# Altium schematic sheet Bluetooth.SchDoc: Bluetooth Module
size OrCAD A; DocumentNumber: LM_011; Revision: -; SheetNumber: 1; SheetTotal: 1
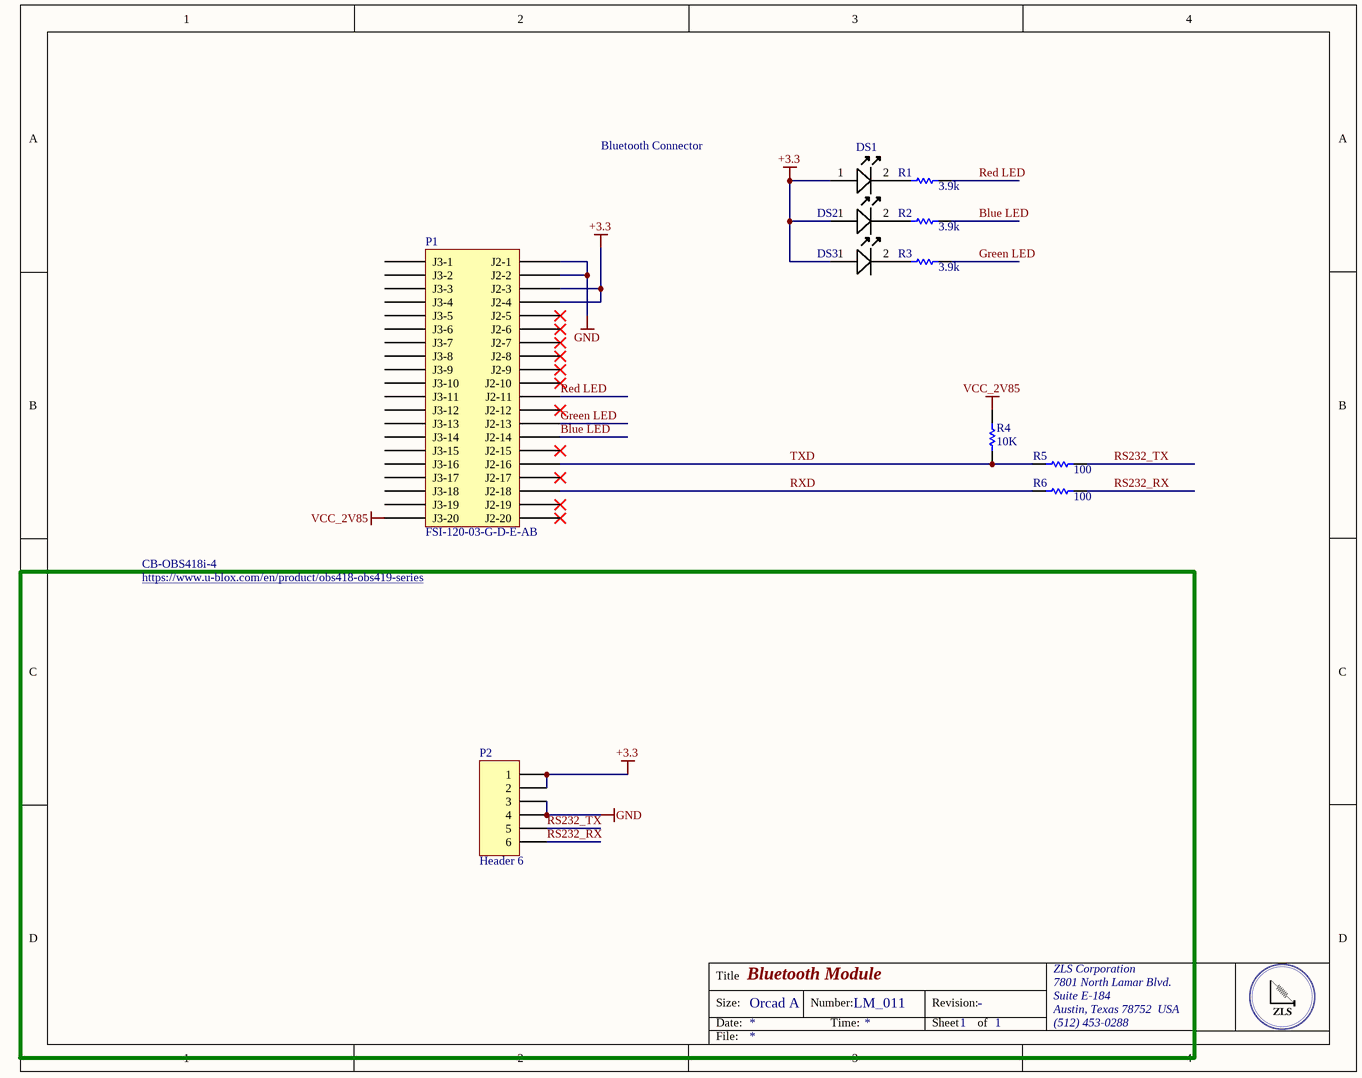
[diagram p0: Bluetooth.SchDoc]

## Parts
DS1  Lite-On LTST-S220KGKT Green LED, 571 nm 2012 (0805) Side View, Rectangle Lens SMD package  [0805C_L]  (value not drawn)
DS2  Lite-On LTST-S220KGKT Green LED, 571 nm 2012 (0805) Side View, Rectangle Lens SMD package  [0805C_L]  (value not drawn)
DS3  Lite-On LTST-S220KGKT Green LED, 571 nm 2012 (0805) Side View, Rectangle Lens SMD package  [0805C_L]  (value not drawn)
P1  FSI-120-03-G-D-E-AB  [FSI-120-03-G-D-E-AB]
P2  Header 6  [HDR1X6]
R1  3.9k  [RESC0805(2012)_L]
R2  3.9k  [RESC0805(2012)_L]
R3  3.9k  [RESC0805(2012)_L]
R4  10K  [RESC0805(2012)_L]
R5  100  [RESC0805(2012)_L]
R6  100  [RESC0805(2012)_L]

## Nets
+3.3: DS1.1(A) DS2.1(A) DS3.1(A) P1.J2-3 P1.J2-4 P2.1 P2.2
GND: P1.J2-1 P1.J2-2 P2.3 P2.4
VCC_2V85: P1.J3-20 R4.1
Blue LED: P1.J2-14 R2.1
Green LED: P1.J2-13 R3.1
Red LED: P1.J2-11 R1.1
RS232_RX: P2.6 R6.1
RS232_TX: P2.5 R5.1
RXD: P1.J2-18 R6.2
TXD: P1.J2-16 R4.2 R5.2
NetDS1_2: DS1.2(K) R1.2
NetDS2_2: DS2.2(K) R2.2
NetDS3_2: DS3.2(K) R3.2

Not connected (* = marked no-connect by the designer): P1 J2-5* J2-6* J2-7* J2-8* J2-9* J2-10* J2-12* J2-15* J2-17* J2-19* J2-20* J3-1 J3-2 J3-3 J3-4 J3-5 J3-6 J3-7 J3-8 J3-9 J3-10 J3-11 J3-12 J3-13 J3-14 J3-15 J3-16 J3-17 J3-18 J3-19

## Notes on the sheet
- Bluetooth Connector
- CB-OBS418i-4
- https://www.u-blox.com/en/product/obs418-obs419-series
- Title
- Size:
- Date:
- Orcad A
- Number:
- Time:
- Revision:
- Sheet
- of
- ZLS Corporation
- 7801 North Lamar Blvd.
- Suite E-184
- Austin, Texas 78752  USA
- (512) 453-0288
- File:

## Library data of the parts
DS1-DS3 = LED A/K: Manufacturer: Vishay / Lite-On; Lens Colour: Colorless; Viewing Angle: 130°; Luminous Intensity: 35mcd; Forward Current: 20mA; Forward Voltage: 2V; Lens Style: Diffused,Colorless; Power Rating: 75mW; Dominant Wavelength: 568nm; Lens Transparency: Clear; Number of Elements: 1; Power Dissipation: 75W; Wavelength: 574nm; Supplier 1: Digi-Key; Supplier Part Number 1: 160-1468-1-ND; Manufacturer Part Number: LTST-S220KGKT; Stock 1: 74800; Pricing 1: 1=0.29, 10=0.212, 25=0.1564, 100=0.1117, 250=0.0759, 500=0.067, 1000=0.0525 (USD); Mount: Surface Mount; Case/Package: 0805; Number of Pins: 2; Colour: Green; Case Code (Metric): 2012; Case Code (Imperial): 0805; Min Operating Temperature: -55°C; Max Operating Temperature: 85°C; Packaging: Tape and Reel; Package Quantity: 4000; Illumination Colour: Green; Test Current: 20mA; Number of LEDs: 1; Length: 2.1mm; Height: 0.6mm; Width: 1mm; Depth: 0.6mm; Radiation Hardening: No; Lead Free: Lead Free; ComponentLink1URL: https://datasheet.ciiva.com/11775/0900766b80dc0b70-11775441.pdf; ComponentLink1Description: https://datasheet.ciiva.com/11775/0900766b80dc0b70-11775441.pdf; ComponentLink2URL: https://datasheet.ciiva.com/2110/s-110-ltst-s220kgkt-2110069.pdf; ComponentLink2Description: https://datasheet.ciiva.com/2110/s-110-ltst-s220kgkt-2110069.pdf; ComponentLink3URL: https://datasheet.ciiva.com/2110/s-110-ltst-s220kgkt-2110070.pdf; ComponentLink3Description: https://datasheet.ciiva.com/2110/s-110-ltst-s220kgkt-2110070.pdf; ComponentLink4URL: https://datasheet.ciiva.com/12400/100-ltst-s220kgkt-59602-12400886.pdf; ComponentLink4Description: https://datasheet.ciiva.com/12400/100-ltst-s220kgkt-59602-12400886.pdf; ComponentLink5URL: https://datasheet.ciiva.com/2110/s-110-ltst-s220kgkt-2110071.pdf; ComponentLink5Description: https://datasheet.ciiva.com/2110/s-110-ltst-s220kgkt-2110071.pdf; ComponentLink6URL: https://datasheet.ciiva.com/16379/ltst-s220kgkt-16379082.pdf; ComponentLink6Description: https://datasheet.ciiva.com/16379/ltst-s220kgkt-16379082.pdf; Supplier 2: Farnell; Supplier Part Number 2: 2062310; RoHS: YES; Stock 2: 2271; Pricing 2: 1=0.325, 10=0.317, 100=0.23, 200=0.228, 400=0.182, 900=0.147, 3000=0.114, 9000=0.107 (GBP); ComponentLink7URL: http://www.farnell.com/cad/2124774.pdf; ComponentLink7Description: http://www.farnell.com/cad/2124774.pdf; ComponentLink8URL: http://www.farnell.com/datasheets/693084.pdf; ComponentLink8Description: http://www.farnell.com/datasheets/693084.pdf
P2 = Header 6: Header, 6-Pin; LatestRevisionDate: 17-Jul-2002; LatestRevisionNote: Re-released for DXP Platform.; Publisher: Altium Limited
R1-R3 = CMP-1013-00215-1: 2R55 0.125W 1% 0805 (2012 Metric)  SMD; Case-Metric: 2012; Case-EIA: 0805; Value: 3.9k; Tolerance: 1 %; Technology: SMT; Power: 0.125 W
R4-R6 = CMP-1013-00215-1: 2R55 0.125W 1% 0805 (2012 Metric)  SMD; Case-Metric: 2012; Value: 3.9k; Case-EIA: 0805; Tolerance: 1 %; Technology: SMT; Power: 0.125 W
P1 = FSI-120-03-G-D-E-AB: Supplier 1: Avnet; Supplier Part Number 1: FSI-120-03-G-D-E-AB